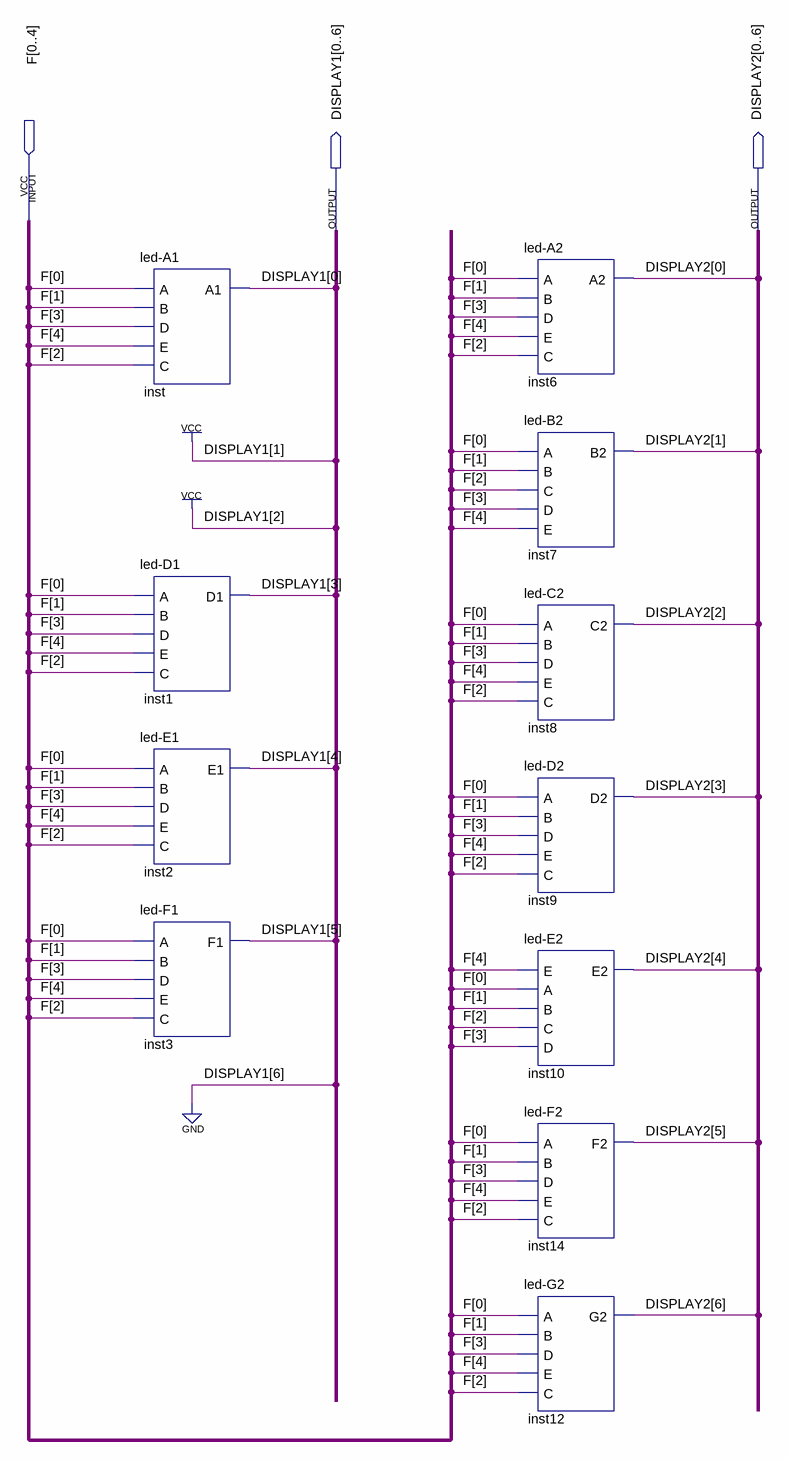
[diagram p0: schematic sheet]
// Quartus schematic decodificador.bdf as structural Verilog: 11 symbols, 3 pins
module decodificador (
  input  [0:4] F,
  output [0:6] DISPLAY1,
  output [0:6] DISPLAY2
);

  \led-A1  inst (.A(F[0]), .B(F[1]), .D(F[3]), .E(F[4]), .C(F[2]), .A1(DISPLAY1[0]));
  \led-D1  inst1 (.A(F[0]), .B(F[1]), .D(F[3]), .E(F[4]), .C(F[2]), .D1(DISPLAY1[3]));
  \led-E1  inst2 (.A(F[0]), .B(F[1]), .D(F[3]), .E(F[4]), .C(F[2]), .E1(DISPLAY1[4]));
  \led-F1  inst3 (.A(F[0]), .B(F[1]), .D(F[3]), .E(F[4]), .C(F[2]), .F1(DISPLAY1[5]));
  \led-A2  inst6 (.A(F[0]), .B(F[1]), .D(F[3]), .E(F[4]), .C(F[2]), .A2(DISPLAY2[0]));
  \led-B2  inst7 (.A(F[0]), .B(F[1]), .C(F[2]), .D(F[3]), .E(F[4]), .B2(DISPLAY2[1]));
  \led-C2  inst8 (.A(F[0]), .B(F[1]), .D(F[3]), .E(F[4]), .C(F[2]), .C2(DISPLAY2[2]));
  \led-D2  inst9 (.A(F[0]), .B(F[1]), .D(F[3]), .E(F[4]), .C(F[2]), .D2(DISPLAY2[3]));
  \led-E2  inst10 (.E(F[4]), .A(F[0]), .B(F[1]), .C(F[2]), .D(F[3]), .E2(DISPLAY2[4]));
  \led-F2  inst14 (.A(F[0]), .B(F[1]), .D(F[3]), .E(F[4]), .C(F[2]), .F2(DISPLAY2[5]));
  \led-G2  inst12 (.A(F[0]), .B(F[1]), .D(F[3]), .E(F[4]), .C(F[2]), .G2(DISPLAY2[6]));

  assign {DISPLAY1[1:2], DISPLAY1[6]} = 3'b110;
endmodule
